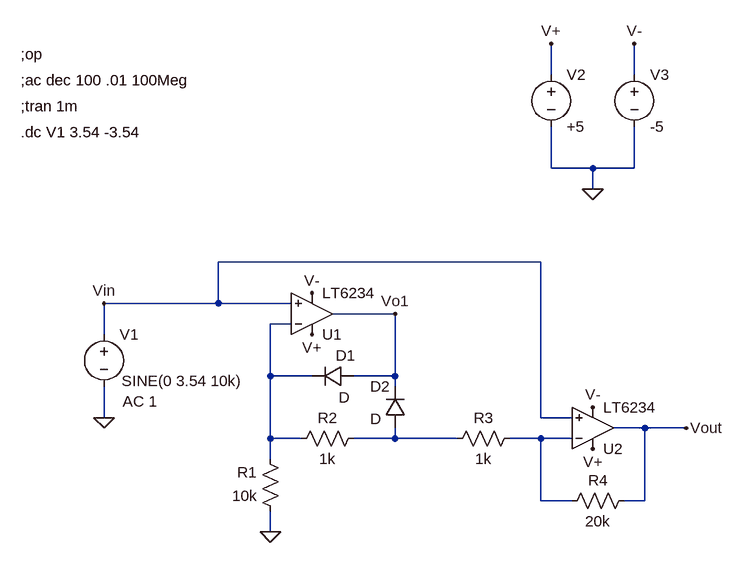
[diagram p0: schematic ETAJUL4_REDRESOR.asc]
ETAJUL4_REDRESOR.asc, the LTspice schematic file:
Version 4
SHEET 1 880 680
WIRE 464 -272 464 -320
WIRE 592 -272 592 -320
WIRE 464 -128 464 -192
WIRE 528 -128 464 -128
WIRE 592 -128 592 -192
WIRE 592 -128 528 -128
WIRE 528 -96 528 -128
WIRE 448 16 -48 16
WIRE -48 80 -48 16
WIRE -48 80 -224 80
WIRE 64 80 -48 80
WIRE 224 96 128 96
WIRE 64 112 32 112
WIRE -224 128 -224 80
WIRE 32 192 32 112
WIRE 96 192 32 192
WIRE 224 192 224 96
WIRE 224 192 160 192
WIRE 224 208 224 192
WIRE -224 256 -224 208
WIRE 448 256 448 16
WIRE 496 256 448 256
WIRE 608 272 560 272
WIRE 672 272 608 272
WIRE 32 288 32 192
WIRE 80 288 32 288
WIRE 224 288 224 272
WIRE 224 288 160 288
WIRE 320 288 224 288
WIRE 448 288 400 288
WIRE 496 288 448 288
WIRE 32 320 32 288
WIRE 448 384 448 288
WIRE 496 384 448 384
WIRE 608 384 608 272
WIRE 608 384 576 384
WIRE 32 432 32 400
FLAG 672 272 Vout
FLAG -224 256 0
FLAG 528 -96 0
FLAG 464 -320 V+
FLAG 96 128 V+
FLAG 528 304 V+
FLAG 592 -320 V-
FLAG 96 64 V-
FLAG 528 240 V-
FLAG 32 432 0
FLAG 224 96 Vo1
FLAG -224 80 Vin
SYMBOL OpAmps\\LT6234 96 96 M180
SYMATTR InstName U1
SYMBOL OpAmps\\LT6234 528 272 M180
SYMATTR InstName U2
SYMBOL voltage -224 112 R0
WINDOW 3 27 87 Left 2
WINDOW 123 29 119 Left 2
WINDOW 39 0 0 Left 0
SYMATTR Value SINE(0 3.54 10k)
SYMATTR Value2 AC 1
SYMATTR InstName V1
SYMBOL voltage 464 -288 R0
SYMATTR InstName V2
SYMATTR Value +5
SYMBOL voltage 592 -288 R0
SYMATTR InstName V3
SYMATTR Value -5
SYMBOL res 176 272 R90
WINDOW 0 0 56 VBottom 2
WINDOW 3 32 56 VTop 2
SYMATTR InstName R2
SYMATTR Value 1k
SYMBOL res 416 272 R90
WINDOW 0 0 56 VBottom 2
WINDOW 3 32 56 VTop 2
SYMATTR InstName R3
SYMATTR Value 1k
SYMBOL res 48 416 R180
WINDOW 0 36 76 Left 2
WINDOW 3 36 40 Left 2
SYMATTR InstName R1
SYMATTR Value 10k
SYMBOL res 592 368 R90
WINDOW 0 0 56 VBottom 2
WINDOW 3 32 56 VTop 2
SYMATTR InstName R4
SYMATTR Value 20k
SYMBOL diode 160 176 R90
WINDOW 0 0 12 VBottom 2
WINDOW 3 33 14 VTop 2
SYMATTR InstName D1
SYMBOL diode 240 272 R180
WINDOW 0 24 64 Left 2
WINDOW 3 37 14 Left 2
SYMATTR InstName D2
TEXT -352 -304 Left 2 !;op
TEXT -352 -264 Left 2 !;ac dec 100 .01 100Meg
TEXT -352 -224 Left 2 !;tran 1m
TEXT -352 -184 Left 2 !.dc V1 3.54 -3.54

The netlist it stands for:
* ETAJUL4_REDRESOR.asc
* U1: LT6234 (symbol OpAmps\LT6234 not available, pins judged from their places): In+=Vin In-=N001 V+=V+ V-=V- OUT=Vo1
* U2: LT6234 (symbol OpAmps\LT6234 not available, pins judged from their places): In+=Vin In-=N003 V+=V+ V-=V- OUT=Vout
V1 Vin 0 SINE(0 3.54 10k) AC 1
V2 V+ 0 +5
V3 V- 0 -5
R2 N002 N001 1k
R3 N003 N002 1k
R1 0 N001 10k
R4 Vout N003 20k
D1 Vo1 N001 D
D2 N002 Vo1 D
.model D D
.lib standard.dio
;op
;ac dec 100 .01 100Meg
;tran 1m
.dc V1 3.54 -3.54
.backanno
.end